# EasyEDA Pro project H桥.eprj, board 三相_TDSON-8
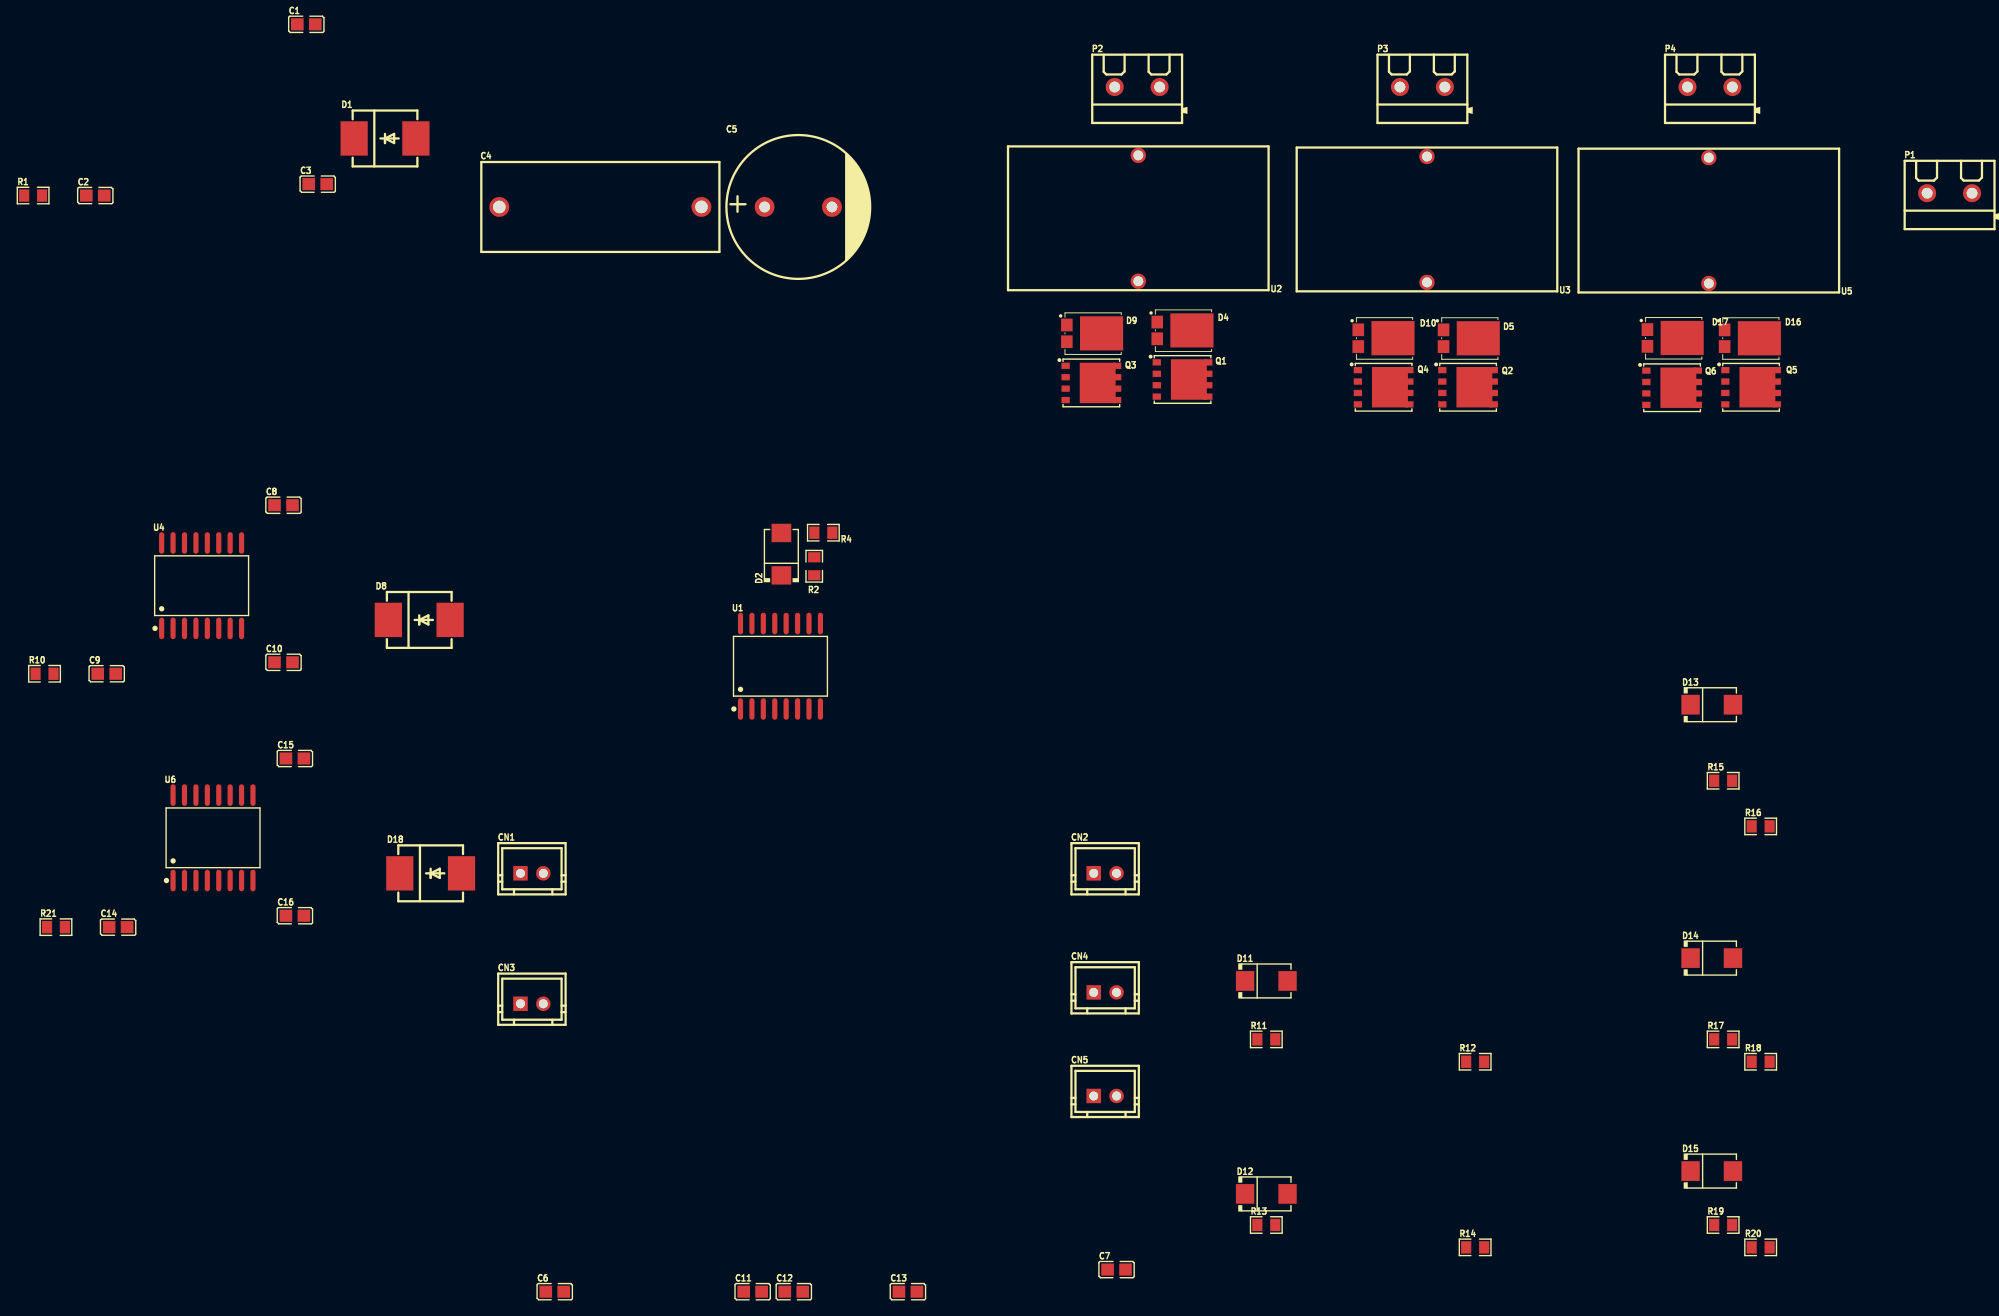
[diagram p5: board, top side]
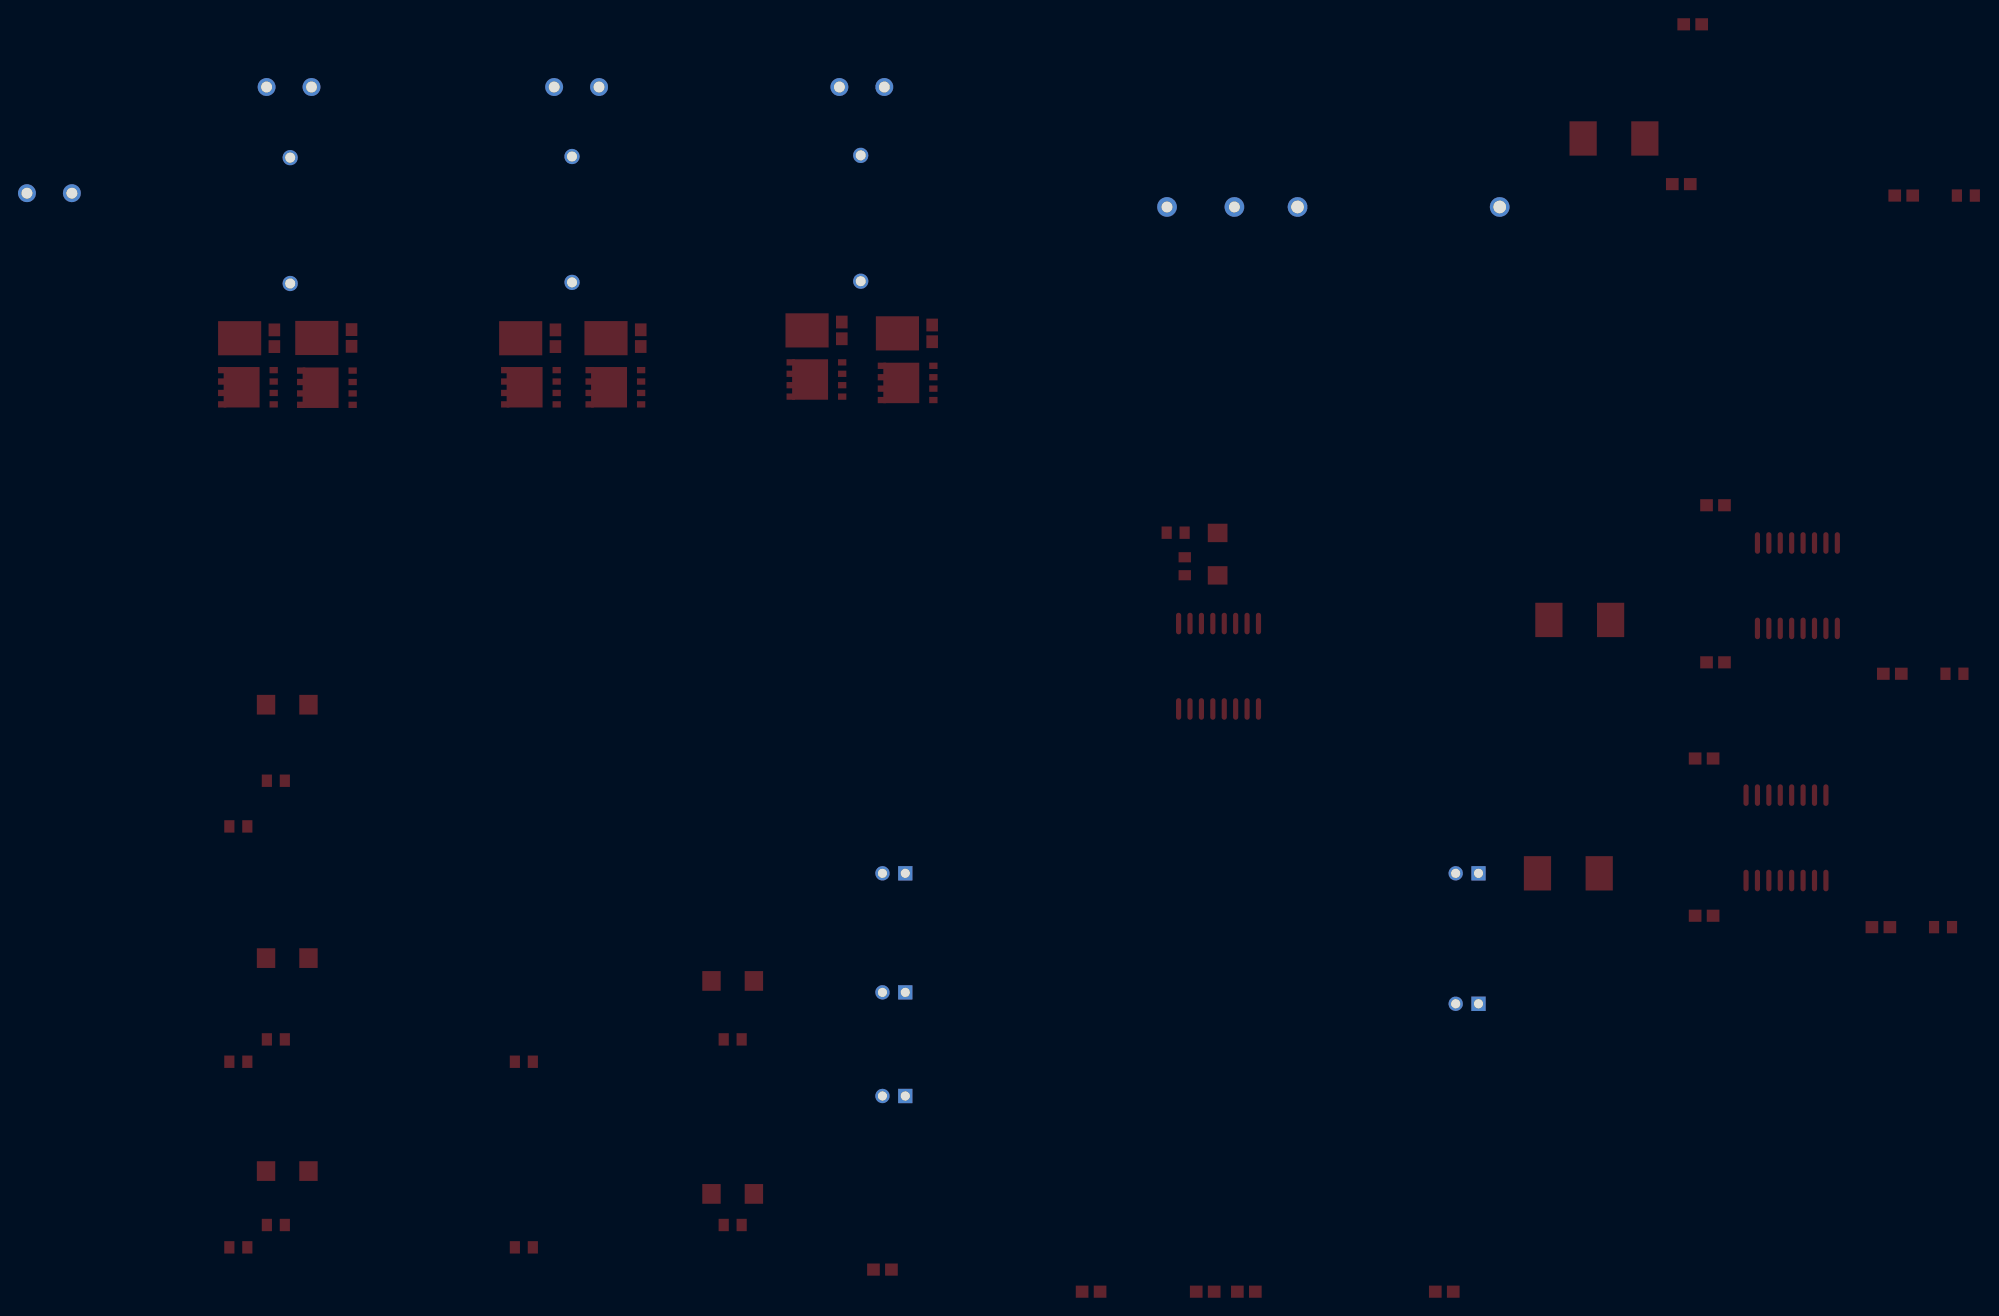
[diagram p6: board, bottom side, seen from below]

No outline. copper layers: Top Layer, Bottom Layer. Coordinates in mm from the lowest, leftmost part position.
Stack: Top Layer 0.035mm / Dielectric1 1.51mm FR4 er 4.5 / Bottom Layer 0.035mm

## Design rules (mm)
template: JLCPCB Capability(Two Layers Board)
spacing copperThickness1oz (default): track to track 0.102, other pairs 0.152 to 0.3
spacing copperThickness2oz: track to track 0.203, other pairs 0.152 to 0.3
track width copperThickness1oz (default): min 0.127, default 0.254, max 2.54
track width copperThickness2oz: min 0.203, default 0.254, max 2.54
differential pair differentialPair (default): width min 0.127, default 0.254, max 2.54; gap min 0.152, default 0.152
via viaSize (default): diameter min 0.5, default 0.61, max 10; hole min 0.3, default 0.305, max 6.3

## Placement (name value [footprint] x y rotation side)
C1  1uF  [C0805]  30.4 140.99 0 top
C2  100nF  [C0805]  6.92 121.94 0 top
C3  1uF  [C0805]  31.67 123.21 0 top
C4  1uF  [CAP-TH_L26.5-W10.0-P22.50-D1.4]  63.13 120.67 0 top
C5  470uF  [CAP-TH_BD16.0-P7.50-D1.2-FD]  85.16 120.67 0 top
C6  100nF  [C0805]  58.05 0 0 top
C7  100nF  [C0805]  120.58 2.46 0 top
C8  1uF  [C0805]  27.86 87.49 0 top
C9  100nF  [C0805]  8.19 68.74 0 top
C10  1uF  [C0805]  27.86 70.01 0 top
C11  100nF  [C0805]  80.08 0 0 top
C12  100nF  [C0805]  84.66 0 0 top
C13  100nF  [C0805]  97.36 0 0 top
C14  100nF  [C0805]  9.46 40.55 0 top
C15  1uF  [C0805]  29.13 59.31 0 top
C16  1uF  [C0805]  29.13 41.82 0 top
CN1  CON2-2.54*2P  [CONN-TH_2P-P2.54-V]  55.51 46.54 0 top
CN2  CON2-2.54*2P  [CONN-TH_2P-P2.54-V]  119.31 46.54 0 top
CN3  CON2-2.54*2P  [CONN-TH_2P-P2.54-V]  55.51 32.03 0 top
CN4  CON2-2.54*2P  [CONN-TH_2P-P2.54-V]  119.31 33.3 0 top
CN5  CON2-2.54*2P  [CONN-TH_2P-P2.54-V]  119.31 21.77 0 top
D1  RS3MC  [SMC_L7.1-W6.2-LS8.1-R-RD]  39.16 128.29 0 top
D2  SS34BG  [SMB_L4.6-W3.6-LS5.3-RD]  83.28 82.05 90 top
D4  ST20100L  [TO-277_3P-L5.7-W4.2-LS6.5-BR]  127.04 106.94 180 top
D5  ST20100L  [TO-277_3P-L5.7-W4.2-LS6.5-BR]  158.91 106.07 180 top
D8  RS3MC  [SMC_L7.1-W6.2-LS8.1-R-RD]  42.97 74.73 0 top
D9  ST20100L  [TO-277_3P-L5.7-W4.2-LS6.5-BR]  116.98 106.61 180 top
D10  ST20100L  [TO-277_3P-L5.7-W4.2-LS6.5-BR]  149.42 106.08 180 top
D11  SS34BG  [SMB_L4.6-W3.6-LS5.3-RD]  137.25 34.57 0 top
D12  SS34BG  [SMB_L4.6-W3.6-LS5.3-RD]  137.25 10.88 0 top
D13  SS34BG  [SMB_L4.6-W3.6-LS5.3-RD]  186.83 65.3 0 top
D14  SS34BG  [SMB_L4.6-W3.6-LS5.3-RD]  186.83 37.11 0 top
D15  SS34BG  [SMB_L4.6-W3.6-LS5.3-RD]  186.83 13.42 0 top
D16  ST20100L  [TO-277_3P-L5.7-W4.2-LS6.5-BR]  190.2 106.07 180 top
D17  ST20100L  [TO-277_3P-L5.7-W4.2-LS6.5-BR]  181.61 106.1 180 top
D18  RS3MC  [SMC_L7.1-W6.2-LS8.1-R-RD]  44.24 46.54 0 top
P1  KF301-2P接线端子  [CONN-TH_XY301V-A-5.0-2P]  213.3 122.21 0 top
P2  KF301-2P接线端子  [CONN-TH_XY301V-A-5.0-2P]  122.88 134.02 0 top
P3  KF301-2P接线端子  [CONN-TH_XY301V-A-5.0-2P]  154.63 134.02 0 top
P4  KF301-2P接线端子  [CONN-TH_XY301V-A-5.0-2P]  186.63 134.02 0 top
Q1  BSC0805LS  [PG-TDSON-8_L5.2-W5.9-P1.27-LS6.2-BL-EP]  127.93 101.48 270 top
Q2  BSC0805LS  [PG-TDSON-8_L5.2-W5.9-P1.27-LS6.2-BL-EP]  159.71 100.62 270 top
Q3  BSC0805LS  [PG-TDSON-8_L5.2-W5.9-P1.27-LS6.2-BL-EP]  117.78 101.1 270 top
Q4  BSC0805LS  [PG-TDSON-8_L5.2-W5.9-P1.27-LS6.2-BL-EP]  150.31 100.62 270 top
Q5  BSC0805LS  [PG-TDSON-8_L5.2-W5.9-P1.27-LS6.2-BL-EP]  191.2 100.62 270 top
Q6  BSC0805LS  [PG-TDSON-8_L5.2-W5.9-P1.27-LS6.2-BL-EP]  182.41 100.56 270 top
R1  20kΩ  [R0805]  0 121.94 0 top
R2  2Ω  [R0805]  86.94 80.7 90 top
R4  10kΩ  [R0805]  87.95 84.44 180 top
R10  20kΩ  [R0805]  1.27 68.74 0 top
R11  2Ω  [R0805]  137.25 28.07 0 top
R12  10kΩ  [R0805]  160.5 25.58 0 top
R13  2Ω  [R0805]  137.25 7.42 0 top
R14  10kΩ  [R0805]  160.5 4.93 0 top
R15  2Ω  [R0805]  188.1 56.84 0 top
R16  10kΩ  [R0805]  192.27 51.76 0 top
R17  2Ω  [R0805]  188.1 28.07 0 top
R18  10kΩ  [R0805]  192.27 25.58 0 top
R19  2Ω  [R0805]  188.1 7.42 0 top
R20  10kΩ  [R0805]  192.27 4.93 0 top
R21  20kΩ  [R0805]  2.54 40.55 0 top
U1  UCC21520  [SOIC-16_L10.3-W7.5-P1.27-LS10.3-BL]  83.18 69.58 0 top
U2  860uH  [IND-TH_L29.0-W16.0-P14.00-D0.8]  123 119.41 180 top
U3  860uH  [IND-TH_L29.0-W16.0-P14.00-D0.8]  155.13 119.29 180 top
U4  UCC21520  [SOIC-16_L10.3-W7.5-P1.27-LS10.3-BL]  18.75 78.54 0 top
U5  860uH  [IND-TH_L29.0-W16.0-P14.00-D0.8]  186.5 119.16 180 top
U6  UCC21520  [SOIC-16_L10.3-W7.5-P1.27-LS10.3-BL]  20.02 50.49 0 top

## Footprints (pads in the part's own frame, mm; a bottom-side part is the same pattern mirrored in y, then rotated)
C0805
  rect 1.41x1.35 smd: 1(-1,0) 2(1,0)
CAP-TH_BD16.0-P7.50-D1.2-FD
  round 2.2 hole 1.2: 1(-3.75,0) 2(3.75,0)
CAP-TH_L26.5-W10.0-P22.50-D1.4
  round 2.2 hole 1.4: 1(-11.249,0) 2(11.249,0)
CONN-TH_2P-P2.54-V
  rect 1.6x1.6 hole 1: 1(-1.27,0)
  round 1.6 hole 1: 2(1.27,0)
CONN-TH_XY301V-A-5.0-2P
  round 2 hole 1.2: 1(-2.5,0) 2(2.5,0)
IND-TH_L29.0-W16.0-P14.00-D0.8
  round 1.7 hole 1.1: 1(0,7) 2(0,-7)
PG-TDSON-8_L5.2-W5.9-P1.27-LS6.2-BL-EP
  rect 0.7x0.925 smd: 1(-1.905,-2.865) 2(-0.635,-2.865) 3(0.635,-2.865) 4(1.905,-2.865) 5(1.905,2.865) 6(0.635,2.865) 7(-0.635,2.865) 8(-1.905,2.865)
  rect 4.5x4 smd: 9(0.001,0.705)
R0805
  rect 1.133x1.377 smd: 1(-1,0) 2(1,0)
SMB_L4.6-W3.6-LS5.3-RD
  rect 2.047x2.192 smd: 1(-2.361,0) 2(2.361,0)
SMC_L7.1-W6.2-LS8.1-R-RD
  rect 3.03x3.82 smd: 1(3.435,0) 2(-3.435,0)
SOIC-16_L10.3-W7.5-P1.27-LS10.3-BL
  oval 0.574x2.401 smd: 1(-4.445,-4.75) 2(-3.175,-4.75) 3(-1.905,-4.75) 4(-0.635,-4.75) 5(0.635,-4.75) 6(1.905,-4.75) 7(3.175,-4.75) 8(4.445,-4.75) 9(4.445,4.75) 10(3.175,4.75) 11(1.905,4.75) 12(0.635,4.75) 13(-0.635,4.75) 14(-1.905,4.75) 15(-3.175,4.75) 16(-4.445,4.75)
TO-277_3P-L5.7-W4.2-LS6.5-BR
  rect 1.29x1.423 smd: 1(1.933,-0.93) 3(1.933,0.93)
  rect 4.8x3.8 smd: 2(-1.933,0)

## Nets
As in the schematic.

Pads without a net: U1 7 12 13; U4 7 12 13; U6 7 12 13
